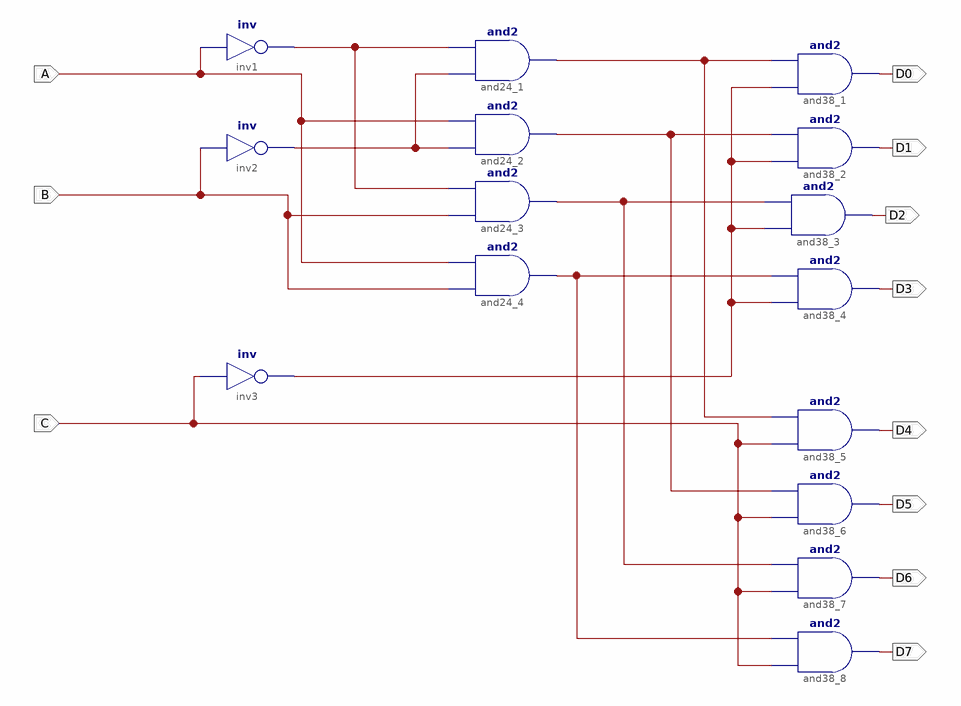
[diagram p0: schematic sheet 1]
// Xilinx ISE schematic decoder_38.sch (kintex7) as structural Verilog: 15 symbols, 11 ports
module decoder_38 (
  input  A,
  input  B,
  input  C,
  output D0,
  output D1,
  output D2,
  output D3,
  output D4,
  output D5,
  output D6,
  output D7
);

  wire XLXN_4, XLXN_13, XLXN_14, XLXN_35, XLXN_36, XLXN_42, XLXN_43;

  and and38_8 (D7, C, XLXN_43);
  and and24_1 (XLXN_35, XLXN_4, XLXN_13);
  and and24_2 (XLXN_36, XLXN_4, A);
  and and24_3 (XLXN_42, B, XLXN_13);
  and and24_4 (XLXN_43, B, A);
  not inv2 (XLXN_4, B);
  not inv1 (XLXN_13, A);
  and and38_1 (D0, XLXN_14, XLXN_35);
  and and38_2 (D1, XLXN_14, XLXN_36);
  and and38_3 (D2, XLXN_14, XLXN_42);
  and and38_5 (D4, C, XLXN_35);
  and and38_6 (D5, C, XLXN_36);
  and and38_7 (D6, C, XLXN_42);
  not inv3 (XLXN_14, C);
  and and38_4 (D3, XLXN_14, XLXN_43);
endmodule
